# Altium project Matrix_mercury.PrjPcb
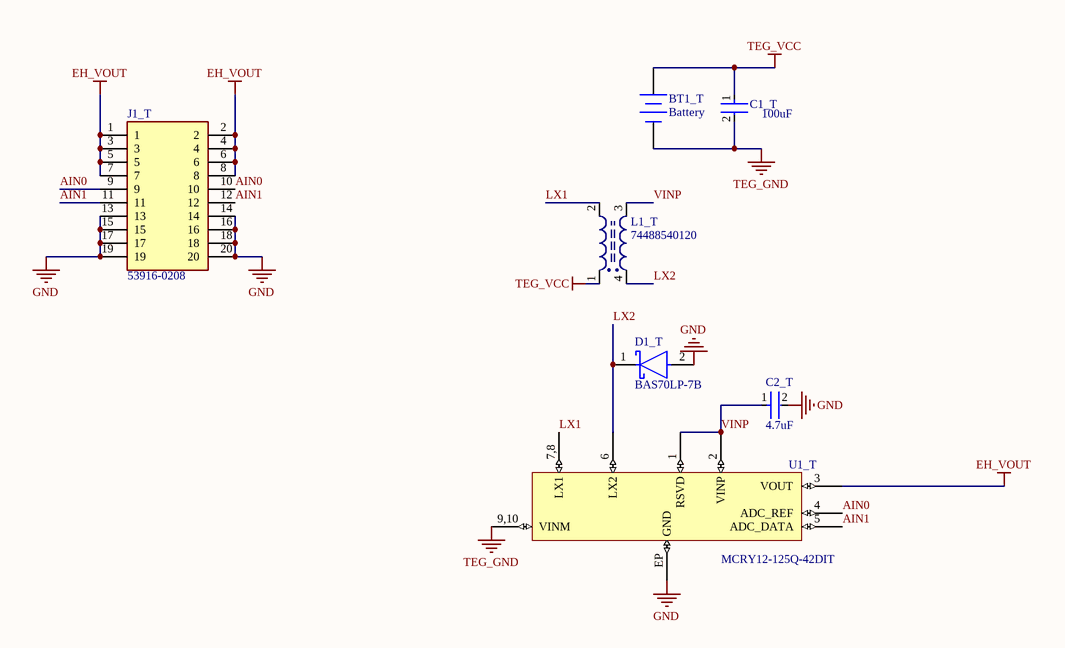
[diagram p0: Sheet1.SchDoc]
1 sheet, 7 parts. Net scope: global (net labels, ports and power ports of the same name join across sheets).
Board file: PCB1.PcbDoc

## Sheet Sheet1.SchDoc
size A; SheetNumber: 1; SheetTotal: 1

### Parts
BT1_T  Battery  [BAT-2]
C1_T  Capacitance: 100uF  [FP-GRM21B-0_2-e0_2_0_7-IPC_C]  (hidden comment: GRM21BR60E107ME15L)
C2_T  Capacitance: 4.7uF  [FP-GRM155-0_15-MFG]  (hidden comment: GRM155R60J475ME87D)
D1_T  BAS70LP-7B  [FP-X1-DFN1006-2-MFG]
J1_T  53916-0208  [MOLEX-  539160208]
L1_T  74488540120  [WE-EHPI 5838]
U1_T  MCRY12-125Q-42DIT  [SON50P300X80_HS-11N]

### Nets
EH_VOUT: J1_T.1 J1_T.2 J1_T.3 J1_T.4 J1_T.5 J1_T.6 J1_T.7 J1_T.8 U1_T.3(VOUT)
GND: C2_T.2 D1_T.2(A) J1_T.13 J1_T.14 J1_T.15 J1_T.16 J1_T.17 J1_T.18 J1_T.19 J1_T.20 U1_T.EP(GND)
TEG_GND: BT1_T.2(-) C1_T.2 U1_T.9,10(VINM)
TEG_VCC: BT1_T.1(+) C1_T.1 L1_T.1
AIN0: J1_T.9 J1_T.10 U1_T.4(ADC_REF)
AIN1: J1_T.11 J1_T.12 U1_T.5(ADC_DATA)
LX1: L1_T.2 U1_T.7,8(LX1)
LX2: D1_T.1(C) L1_T.4 U1_T.6(LX2)
VINP: C2_T.1 L1_T.3 U1_T.1(RSVD) U1_T.2(VINP)

### Library data of the parts
BT1_T = Battery: Multicell Battery; Published: 24-Mar-1999; LatestRevisionDate: 17-Jul-2002; LatestRevisionNote: Re-released for DXP Platform.; PackageReference: BAT-2; Publisher: Altium Limited; PackageDescription: Battery; 2 Leads
C1_T = CMP-06035-029069-1: Chip Multilayer Ceramic Capacitors for General Purpose, 0805, 100uF, X5R, 15%, 20%, 2.5V; Case Code (Imperial): 0805; Width: 0.049inch; Dielectric: X5R; Max Operating Temperature: 85°C; Thickness: 0.057inch; Length: 0.079inch; Min Operating Temperature: -55°C; Voltage Rating (DC): 2.5V; Case Code (Metric): 2012; Voltage Rating: 2.5V; Case/Package: 0805; Packaging: Tape and Reel; Tolerance: 20%; Mount: Surface Mount
C2_T = CMP-2008-04550-5: Chip Multilayer Ceramic Capacitors for General Purpose, 0402, 4.7uF, X5R, 15%, 20%, 6.3V; Packaging: Tape and Reel; REACH SVHC: No SVHC; Case Code (Metric): 1005; Case/Package: 0402; Series: GRM; Construction: Flat; Min Operating Temperature: -55°C; Case Code (Imperial): 0402; Lead Free: Lead Free; Depth: 0.5mm; Height: 0.5mm; Tolerance: 20%; Voltage: 6.3V; Dielectric: X5R; Radiation Hardening: No; Voltage Rating: 6.3V; Max Operating Temperature: 85°C; Thickness: 0.022inch; Voltage Rating (DC): 6.3V; Package Quantity: 1; Width: 0.02inch; Mount: Surface Mount; Length: 1mm
D1_T = CMP-12790-000002-1: DIODE SCHTTKY 70V 70MA X1DFN1006; Manufacturer: Diodes Inc.; Max Surge Forward Current: 800mA; Capacitance: 1pF; Value: 1pF; Max Junction Temp: +150°C; Standoff Height: 0mm; Peak Reverse Current: 0.1uA; Temperature: -65°C to +150°C; Temperature Range High: +150°C; Automotive: No; Category: Diode; Max Repetitive Reverse Voltage: 70V; Digikey Description: DIODE SCHTTKY 70V 70MA X1DFN1006; Device Class L1: Discrete Semiconductors; Lead Free: Yes; Footprint Url: https://www.diodes.com/assets/Package-Files/X1-DFN1006-2.pdf; Temperature Range Low: -65°C; Reverse Voltage: 70V; Forward Current: 70mA; Package: X1-DFN1006-2; RoHS: TRUE; Manufacturer Part Number: BAS70LP-7B; Height: 0.53mm; Octopart: https://octopart.com/bas70lp-7b-diodes+inc.-22053921; Device Class L3: Schottky Diodes; ComponentLink2URL: https://www.diodes.com/assets/Datasheets/BAS70LP.pdf; ComponentLink2Description: Datasheet; Mouser Description: Schottky Diodes & Rectifiers Schottky Diode; Device Class L2: Diodes
L1_T = CMP-1384-00002-1: Energy Harvesting Coupled Inductor,SMD, WE-EHPI, L=13.0 µH; Manufacturer: Wuerth Elektronik; Inductance: 13.0 ÂµH; ComponentLink2URL: http://katalog.we-online.de/pbs/datasheet/74488540120.pdf; PartNumber: 74488540120; ComponentLink1Description: Manufacturer URL; PackageReference: WE-EHPI 5838; ComponentLink1URL: http://www.we-online.com; ComponentLink2Description: Datasheet